# Altium schematic sheet ARD.SchDoc
size A4
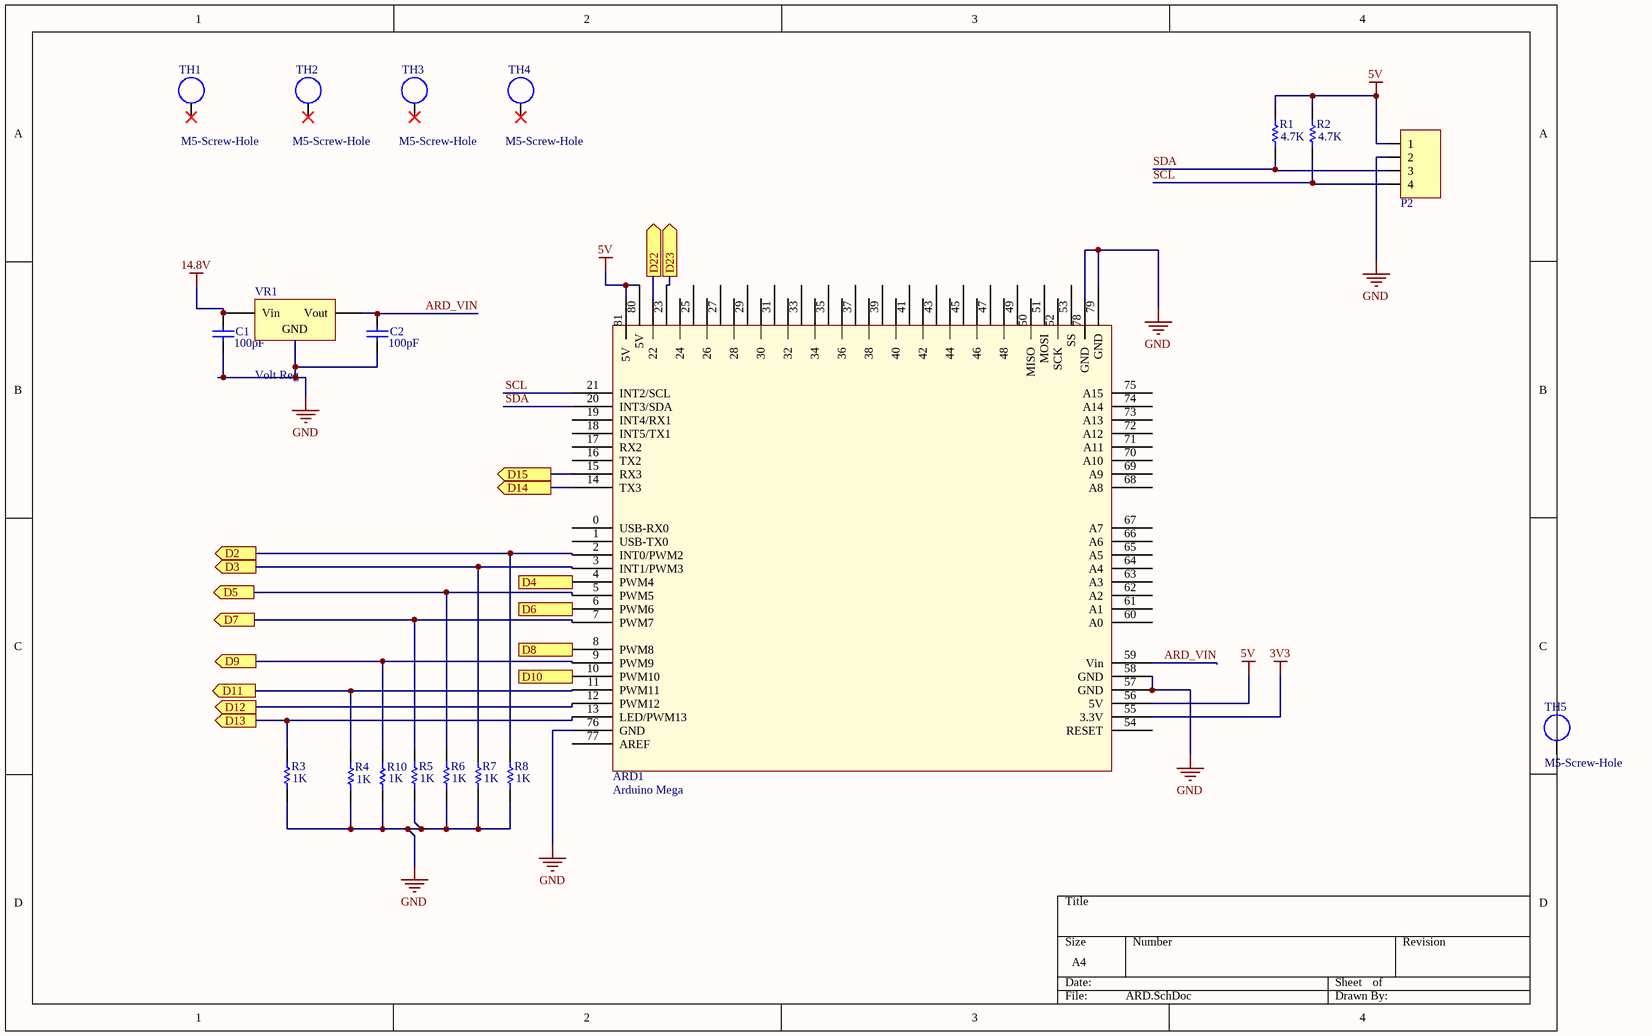
[diagram p0: ARD.SchDoc]

## Parts
ARD1  Arduino Mega  [Arduino Mega]
C1  value 100pF  [C1206]  (hidden comment: Cap Semi)
C2  value 100pF  [C1206]  (hidden comment: Cap Semi)
P2  Mini-Fit Jr 4 Pos  [MOLEX 0039281043]  (value not drawn)
R1  value 4.7K  [RESC1608X06N_0603]  (hidden comment: Res1)
R2  value 4.7K  [RESC1608X06N_0603]  (hidden comment: Res1)
R3  value 1K  [RESC1608X06N_0603]  (hidden comment: Res1)
R4  value 1K  [RESC1608X06N_0603]  (hidden comment: Res1)
R5  value 1K  [RESC1608X06N_0603]  (hidden comment: Res1)
R6  value 1K  [RESC1608X06N_0603]  (hidden comment: Res1)
R7  value 1K  [RESC1608X06N_0603]  (hidden comment: Res1)
R8  value 1K  [RESC1608X06N_0603]  (hidden comment: Res1)
R10  value 1K  [RESC1608X06N_0603]  (hidden comment: Res1)
TH1  M5-Screw-Hole  [M5_Screw_Hole]
TH2  M5-Screw-Hole  [M5_Screw_Hole]
TH3  M5-Screw-Hole  [M5_Screw_Hole]
TH4  M5-Screw-Hole  [M5_Screw_Hole]
TH5  M5-Screw-Hole  [M5_Screw_Hole]
VR1  Volt Reg  [DPAK254P1420X457-3N]

## Ports
D2 (out), D3 (out), D4 (out), D5 (out), D6 (out), D7 (out), D8 (out), D9 (out), D10 (out), D11 (out), D12 (out), D13 (out), D14 (out), D15 (out), D22 (out), D23 (out)

## Nets
3V3: ARD1.55(3.3V)
5V: ARD1.56(5V) ARD1.80(5V) ARD1.81(5V) P2.1 R1.2 R2.2
14.8V: C1.2 VR1.1(Vin)
GND: ARD1.57(GND) ARD1.58(GND) ARD1.76(GND) ARD1.78(GND) ARD1.79(GND) C1.1 C2.1 P2.2 R3.1 R4.1 R5.1 R6.1 R7.1 R8.1 R10.1 VR1.2(GND)
ARD_VIN: ARD1.59(Vin) C2.2 VR1.3(Vout)
D2: ARD1.2(INT0/PWM2) R8.2 ; port D2
D3: ARD1.3(INT1/PWM3) R7.2 ; port D3
D4: ARD1.4(PWM4) ; port D4
D5: ARD1.5(PWM5) R6.2 ; port D5
D6: ARD1.6(PWM6) ; port D6
D7: ARD1.7(PWM7) R5.2 ; port D7
D8: ARD1.8(PWM8) ; port D8
D9: ARD1.9(PWM9) R10.2 ; port D9
D10: ARD1.10(PWM10) ; port D10
D11: ARD1.11(PWM11) R4.2 ; port D11
D12: ARD1.12(PWM12) ; port D12
D13: ARD1.13(LED/PWM13) R3.2 ; port D13
D14: ARD1.14(TX3) ; port D14
D15: ARD1.15(RX3) ; port D15
D22: ARD1.22 ; port D22
D23: ARD1.23 ; port D23
SCL: ARD1.21(INT2/SCL) P2.4 R2.1
SDA: ARD1.20(INT3/SDA) P2.3 R1.1

Not connected (* = marked no-connect by the designer): ARD1 0(USB-RX0) 1(USB-TX0) 16(TX2) 17(RX2) 18(INT5/TX1) 19(INT4/RX1) 24 25 26 27 28 29 30 31 32 33 34 35 36 37 38 39 40 41 42 43 44 45 46 47 48 49 50(MISO) 51(MOSI) 52(SCK) 53(SS) 54(RESET) 60(A0) 61(A1) 62(A2) 63(A3) 64(A4) 65(A5) 66(A6) 67(A7) 68(A8) 69(A9) 70(A10) 71(A11) 72(A12) 73(A13) 74(A14) 75(A15) 77(AREF); TH1 1*; TH2 1*; TH3 1*; TH4 1*; TH5 1

## Library data of the parts
C1 C2 = Cap Semi: Capacitor (Semiconductor SIM Model); Published: 8-Jun-2000; LatestRevisionDate: 29-May-2009; LatestRevisionNote: IPC-7351 Footprint Added.; PackageReference: C1206; Publisher: Altium Limited; PackageDescription: Chip Capacitor
P2 = Molex 0039281043: Mini-Fit Jr. Header, Dual Row, Right-Angle, with Snap-in Plastic Peg PCB Lock, 6 Circuits, PA Polyamide Nylon 6/6 94V-2, 0.76µm Select Gold (Au) Plating
R1-R8 R10 = Res1: Resistor; Published: 8-Jun-2000; LatestRevisionDate: 17-Jul-2002; LatestRevisionNote: Re-released for DXP Platform.; PackageReference: AXIAL-0.3; Publisher: Altium Limited; PackageDescription: Axial Device, Thru-Hole; 2 Leads; 0.3 in Pin Spacing
VR1 = Volt Reg: Voltage Regulator; Published: 24-Mar-1999; LatestRevisionDate: 29-May-2009; LatestRevisionNote: IPC-7351 Footprint Added.; PackageReference: D2PAK; Publisher: Altium Limited; PackageDescription: 3-Pin Transistor Outline Package 2.54 mm Pitch, 15.1 mm Lead Span